# Altium schematic sheet ActuatorMKII_Microcontroller.SchDoc: Microcontroller
size B; Date: 09/17/2022; Author: Dylan Trainor; Organization: ORGANIZATION; Address1: ADDRESS 1; Address2: ADDRESS 2; Address3: ADDRESS 3; Address4: ADDRESS 4; DocumentNumber: 4; Revision: -; SheetNumber: 7; SheetTotal: 8; ENG_APP_DATE: --/--/--; DSN_APP_DATE: --/--/--; CHK_APP_DATE: --/--/--
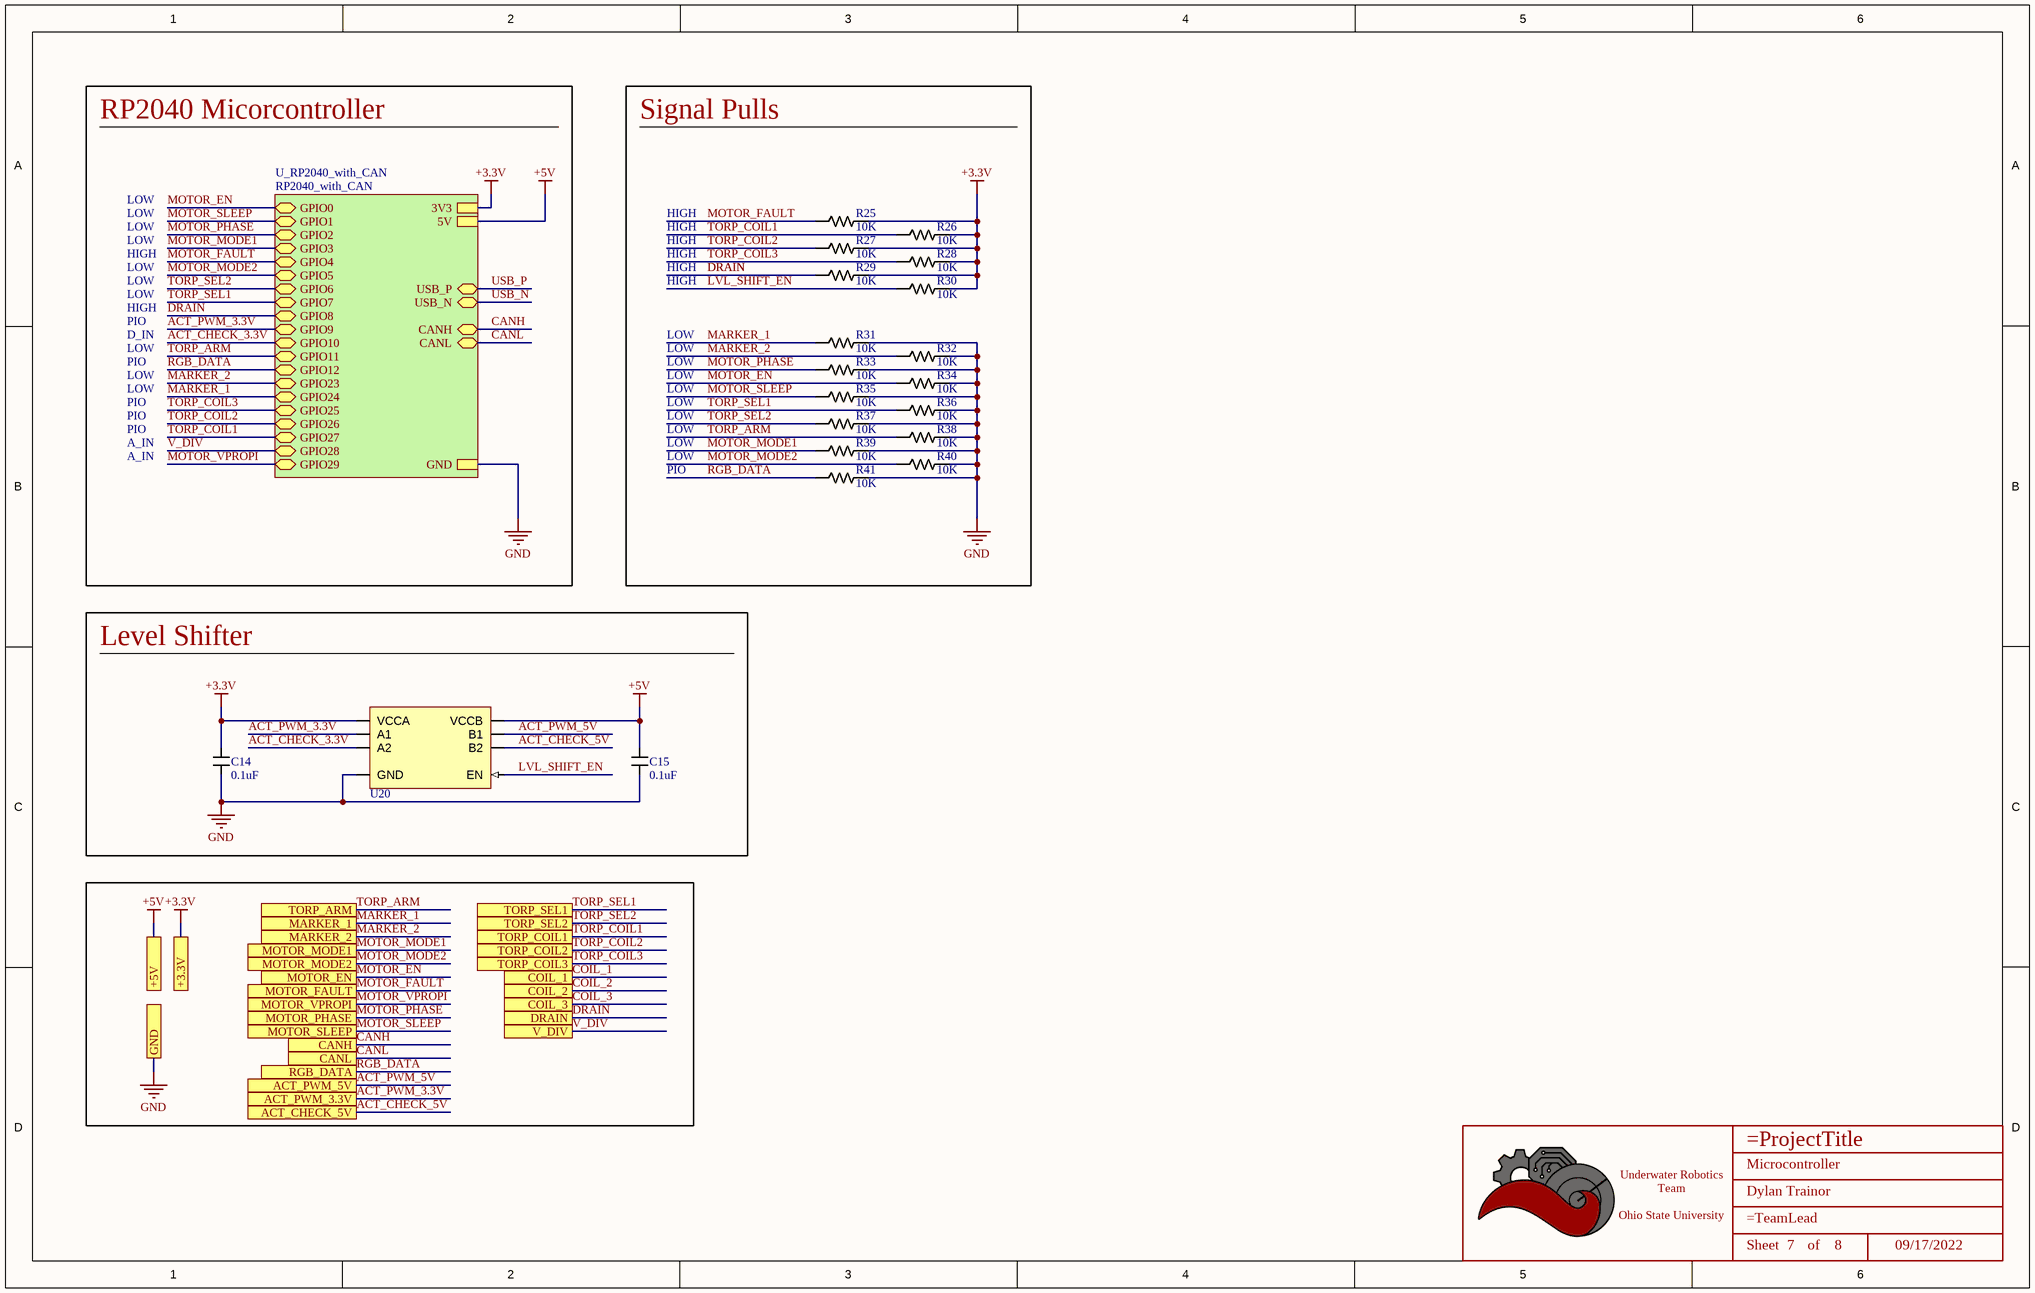
[diagram p0: ActuatorMKII_Microcontroller.SchDoc]

## Parts
*  Title_Block  [LOGO]  (value not drawn)  (graphical)
C14  value 0.1uF  [CAPACITOR_0603]  (hidden comment: 100nF Ceramic 6.3V)
C15  value 0.1uF  [CAPACITOR_0603]  (hidden comment: 100nF Ceramic 6.3V)
R25  Value  (Ohms): 10K  [RESISTOR_0603]  (hidden comment: 10k Ohm 5% 1/10W)
R26  Value  (Ohms): 10K  [RESISTOR_0603]  (hidden comment: 10k Ohm 5% 1/10W)
R27  Value  (Ohms): 10K  [RESISTOR_0603]  (hidden comment: 10k Ohm 5% 1/10W)
R28  Value  (Ohms): 10K  [RESISTOR_0603]  (hidden comment: 10k Ohm 5% 1/10W)
R29  Value  (Ohms): 10K  [RESISTOR_0603]  (hidden comment: 10k Ohm 5% 1/10W)
R30  Value  (Ohms): 10K  [RESISTOR_0603]  (hidden comment: 10k Ohm 5% 1/10W)
R31  Value  (Ohms): 10K  [RESISTOR_0603]  (hidden comment: 10k Ohm 5% 1/10W)
R32  Value  (Ohms): 10K  [RESISTOR_0603]  (hidden comment: 10k Ohm 5% 1/10W)
R33  Value  (Ohms): 10K  [RESISTOR_0603]  (hidden comment: 10k Ohm 5% 1/10W)
R34  Value  (Ohms): 10K  [RESISTOR_0603]  (hidden comment: 10k Ohm 5% 1/10W)
R35  Value  (Ohms): 10K  [RESISTOR_0603]  (hidden comment: 10k Ohm 5% 1/10W)
R36  Value  (Ohms): 10K  [RESISTOR_0603]  (hidden comment: 10k Ohm 5% 1/10W)
R37  Value  (Ohms): 10K  [RESISTOR_0603]  (hidden comment: 10k Ohm 5% 1/10W)
R38  Value  (Ohms): 10K  [RESISTOR_0603]  (hidden comment: 10k Ohm 5% 1/10W)
R39  Value  (Ohms): 10K  [RESISTOR_0603]  (hidden comment: 10k Ohm 5% 1/10W)
R40  Value  (Ohms): 10K  [RESISTOR_0603]  (hidden comment: 10k Ohm 5% 1/10W)
R41  Value  (Ohms): 10K  [RESISTOR_0603]  (hidden comment: 10k Ohm 5% 1/10W)
U20  IC TRANSLTR BIDIRECTIONAL 8MSOP  [MSOP-8_PI4ULS5V202UEX]  (value not drawn)

## Blocks framed on the sheet
Signal Pulls: R25-R41
Level Shifter: C14 C15 U20

## Sub-sheets
U_RP2040_with_CAN = RP2040_with_CAN: USB_P (bidir), USB_N (bidir), 5V, CANH (bidir), CANL (bidir), GPIO0 (bidir), GPIO1 (bidir), GPIO2 (bidir), GPIO3 (bidir), GPIO4 (bidir), GPIO5 (bidir), GPIO6 (bidir), GPIO7 (bidir), GPIO8 (bidir), GPIO9 (bidir), GPIO10 (bidir), GPIO11 (bidir), GPIO12 (bidir), GPIO23 (bidir), GPIO24 (bidir), GPIO25 (bidir), GPIO26 (bidir), GPIO27 (bidir), GPIO28 (bidir), GPIO29 (bidir), 3V3, GND

## Ports
+3.3V, +5V, ACT_CHECK_5V, ACT_PWM_3.3V, ACT_PWM_5V, CANH, CANL, COIL_1, COIL_2, COIL_3, DRAIN, GND, MARKER_1, MARKER_2, MOTOR_EN, MOTOR_FAULT, MOTOR_MODE1, MOTOR_MODE2, MOTOR_PHASE, MOTOR_SLEEP, MOTOR_VPROPI, RGB_DATA, TORP_ARM, TORP_COIL1, TORP_COIL2, TORP_COIL3, TORP_SEL1, TORP_SEL2, V_DIV

## Nets
+3.3V: C14.1 R25.1 R26.1 R27.1 R28.1 R29.1 R30.1 U20.1(VCCA) ; port +3.3V, sheet U_RP2040_with_CAN/3V3
+5V: C15.1 U20.8(VCCB) ; port +5V, sheet U_RP2040_with_CAN/5V
GND: C14.2 C15.2 R31.1 R32.1 R33.1 R34.1 R35.1 R36.1 R37.1 R38.1 R39.1 R40.1 R41.1 U20.4(GND) ; port GND, sheet U_RP2040_with_CAN/GND
ACT_CHECK_3.3V: U20.3(A2) ; sheet U_RP2040_with_CAN/GPIO10
ACT_CHECK_5V: U20.6(B2) ; port ACT_CHECK_5V
ACT_PWM_3.3V: U20.2(A1) ; port ACT_PWM_3.3V, sheet U_RP2040_with_CAN/GPIO9
ACT_PWM_5V: U20.7(B1) ; port ACT_PWM_5V
CANH: port CANH, sheet U_RP2040_with_CAN/CANH
CANL: port CANL, sheet U_RP2040_with_CAN/CANL
COIL_1: port COIL_1
COIL_2: port COIL_2
COIL_3: port COIL_3
DRAIN: R29.2 ; port DRAIN, sheet U_RP2040_with_CAN/GPIO8
LVL_SHIFT_EN: R30.2 U20.5(EN)
MARKER_1: R31.2 ; port MARKER_1, sheet U_RP2040_with_CAN/GPIO24
MARKER_2: R32.2 ; port MARKER_2, sheet U_RP2040_with_CAN/GPIO23
MOTOR_EN: R34.2 ; port MOTOR_EN, sheet U_RP2040_with_CAN/GPIO0
MOTOR_FAULT: R25.2 ; port MOTOR_FAULT, sheet U_RP2040_with_CAN/GPIO4
MOTOR_MODE1: R39.2 ; port MOTOR_MODE1, sheet U_RP2040_with_CAN/GPIO3
MOTOR_MODE2: R40.2 ; port MOTOR_MODE2, sheet U_RP2040_with_CAN/GPIO5
MOTOR_PHASE: R33.2 ; port MOTOR_PHASE, sheet U_RP2040_with_CAN/GPIO2
MOTOR_SLEEP: R35.2 ; port MOTOR_SLEEP, sheet U_RP2040_with_CAN/GPIO1
MOTOR_VPROPI: port MOTOR_VPROPI, sheet U_RP2040_with_CAN/GPIO29
RGB_DATA: R41.2 ; port RGB_DATA, sheet U_RP2040_with_CAN/GPIO12
TORP_ARM: R38.2 ; port TORP_ARM, sheet U_RP2040_with_CAN/GPIO11
TORP_COIL1: R26.2 ; port TORP_COIL1, sheet U_RP2040_with_CAN/GPIO27
TORP_COIL2: R27.2 ; port TORP_COIL2, sheet U_RP2040_with_CAN/GPIO26
TORP_COIL3: R28.2 ; port TORP_COIL3, sheet U_RP2040_with_CAN/GPIO25
TORP_SEL1: R36.2 ; port TORP_SEL1, sheet U_RP2040_with_CAN/GPIO7
TORP_SEL2: R37.2 ; port TORP_SEL2, sheet U_RP2040_with_CAN/GPIO6
USB_N: sheet U_RP2040_with_CAN/USB_N
USB_P: sheet U_RP2040_with_CAN/USB_P
V_DIV: port V_DIV, sheet U_RP2040_with_CAN/GPIO28

## Notes on the sheet
- RP2040 Micorcontroller
- LOW
- HIGH
- D_IN
- PIO
- A_IN
- DWG. NO.
- REV.
- SHT.
- THIS DOCUMENT AND THE DATA DISCLOSED HEREIN OR HEREWITH IS THE PROPERTY OF ALTIUM LIMITED AND MAY BE FREELY DISTRIBUTED IN WHOLE. NO RIGHTS ARE RESERVED OR EXPRESS OR IMPLIED WARANTEE GIVEN.
- REVISION
- DESCRIPTION
- DATE
- APPROVED
- ENG:
- APPROVALS
- PROJECT
- DSN:
- CHK:
- REFERENCE DOCUMENTS
- PROJECT REVISION:
- TITLE
- DOCUMENT REVISION:
- DESIGN ITEM:
- BOM:
- FAB DWG:
- PCB DWG:
- ASSY DWG:
- SCALE:
- SIZE
- B
- CAGE CODE
- FILE NAME
- DWG NO.
- SHEET
- OF
- REV
- (in symbol Title_Block) Underwater Robotics Team / Ohio State University; Sheet; of

## Library data of the parts
* = Title_Block: UWRT Schematic Title Block Template / Created June 2021, Dylan Trainor
C14 C15 = CAPACITOR_0.1uF_0603: Cap 100nF 6.3V +/-10% / Ceramic 0603; Made By: Flip B; ComponentLink1Description: Datsheet; ComponentLink1URL: https://www.mouser.com/datasheet/2/212/KEM_C1002_X7R_SMD-1102033.pdf; Tolerance: +/- 10%; Voltage: 6.3V; Supplier 1: Digi-Key; Supplier Part Number 1: 399-15351-1-ND
R25-R41 = RESISTOR_10K_0603: RES 10k OHM 5% 1/10W 0603; Tolerance: +/- 5%; Wattage: 1/8W; Made By: Robert Pafford; ComponentLink1Description: Datasheet; ComponentLink1URL: https://www.bourns.com/docs/product-datasheets/CRxxxxx.pdf; Supplier: Digikey; Digikey Part Numer: CR0603-JW-104ELFTR-ND; Supplier 1: Digi-Key; Supplier Part Number 1: 2019-RK73B1JTTD103JCT-ND
U20 = PI4ULS5V202UEX: Voltage Level Translator Bidirectional 1 Circuit 2 Channel 20Mbps 8-MSOP; Made By: Robert Pafford; Channels: 2; Voltage Range: 1.2 V ~ 5.5 V; Channel Type: Bidirectional; Max Rate: 20 Mbps; Supplier 1: Digi-Key; Supplier Part Number 1: PI4ULS5V202UEXDICT-ND